# Altium schematic sheet soic-8-breakout-board.SchDoc
size 297 x 209 mm
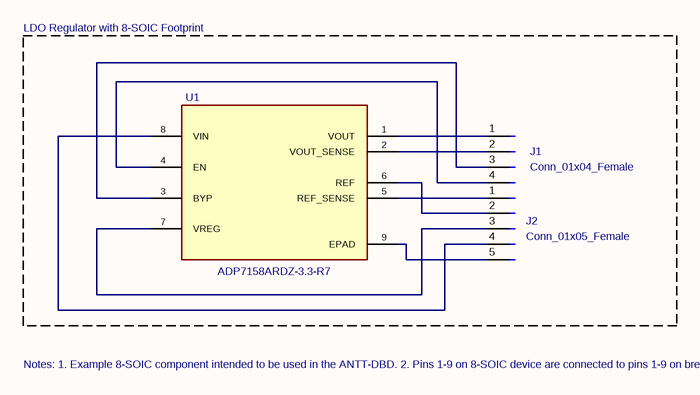
[diagram p0: soic-8-breakout-board.SchDoc]

## Parts
J1  Conn_01x04_Female  [PinSocket_1x04_P2.54mm_Vertical]
J2  Conn_01x05_Female  [PinSocket_1x05_P2.54mm_Vertical]
U1  ADP7158ARDZ-3.3-R7  [SOIC127P600X175-9N]

## Nets
NetJ1_1: J1.1(Pin_1) U1.1(VOUT)
NetJ1_2: J1.2(Pin_2) U1.2(VOUT_SENSE)
NetJ1_3: J1.3(Pin_3) U1.3(BYP)
NetJ1_4: J1.4(Pin_4) U1.4(EN)
NetJ2_1: J2.1(Pin_1) U1.5(REF_SENSE)
NetJ2_2: J2.2(Pin_2) U1.6(REF)
NetJ2_3: J2.3(Pin_3) U1.7(VREG)
NetJ2_4: J2.4(Pin_4) U1.8(VIN)
NetJ2_5: J2.5(Pin_5) U1.9(EPAD)

## Notes on the sheet
- LDO Regulator with 8-SOIC Footprint
- Notes:
  1. Example 8-SOIC component intended to be used in the ANTT-DBD.
  2. Pins 1-9 on 8-SOIC device are connected to pins 1-9 on breakout board.
- 1
- 2
- 3
- 4
- 5
- 6
- A
- B
- C
- D
- Title:
- File: soic-8-breakout-board.kicad_sch
- Sheet: /
- KiCad E.D.A.  kicad (5.1.4)-1
- Size: A4
- Date:
- Rev:
- Id: 1/1

## Library data of the parts
U1 = ADP7158ARDZ-3.3-R7: MANUFACTURER: ANALOG DEVICES; PARTREV: C; SNAPEDA_PN: ADP7158ARDZ-3.3-R7; MAXIMUM_PACKAGE_HEIGHT: 1.75 mm; STANDARD: IPC 7351B; Value: ADP7158ARDZ-3.3-R7
J1 = Conn_01x04_Female: Value: Conn_01x04_Female; Footprint: Connector_PinSocket_2.54mm:PinSocket_1x04_P2.54mm_Vertical
J2 = Conn_01x05_Female: Value: Conn_01x05_Female; Footprint: Connector_PinSocket_2.54mm:PinSocket_1x05_P2.54mm_Vertical